# EAGLE schematic schematic (EAGLE 8.4.3)
CNAME: ZPB30A1; CREVISION: 1.1; DESIGNER: Luca Zimmermann

## Sheet 1 of 4: Power
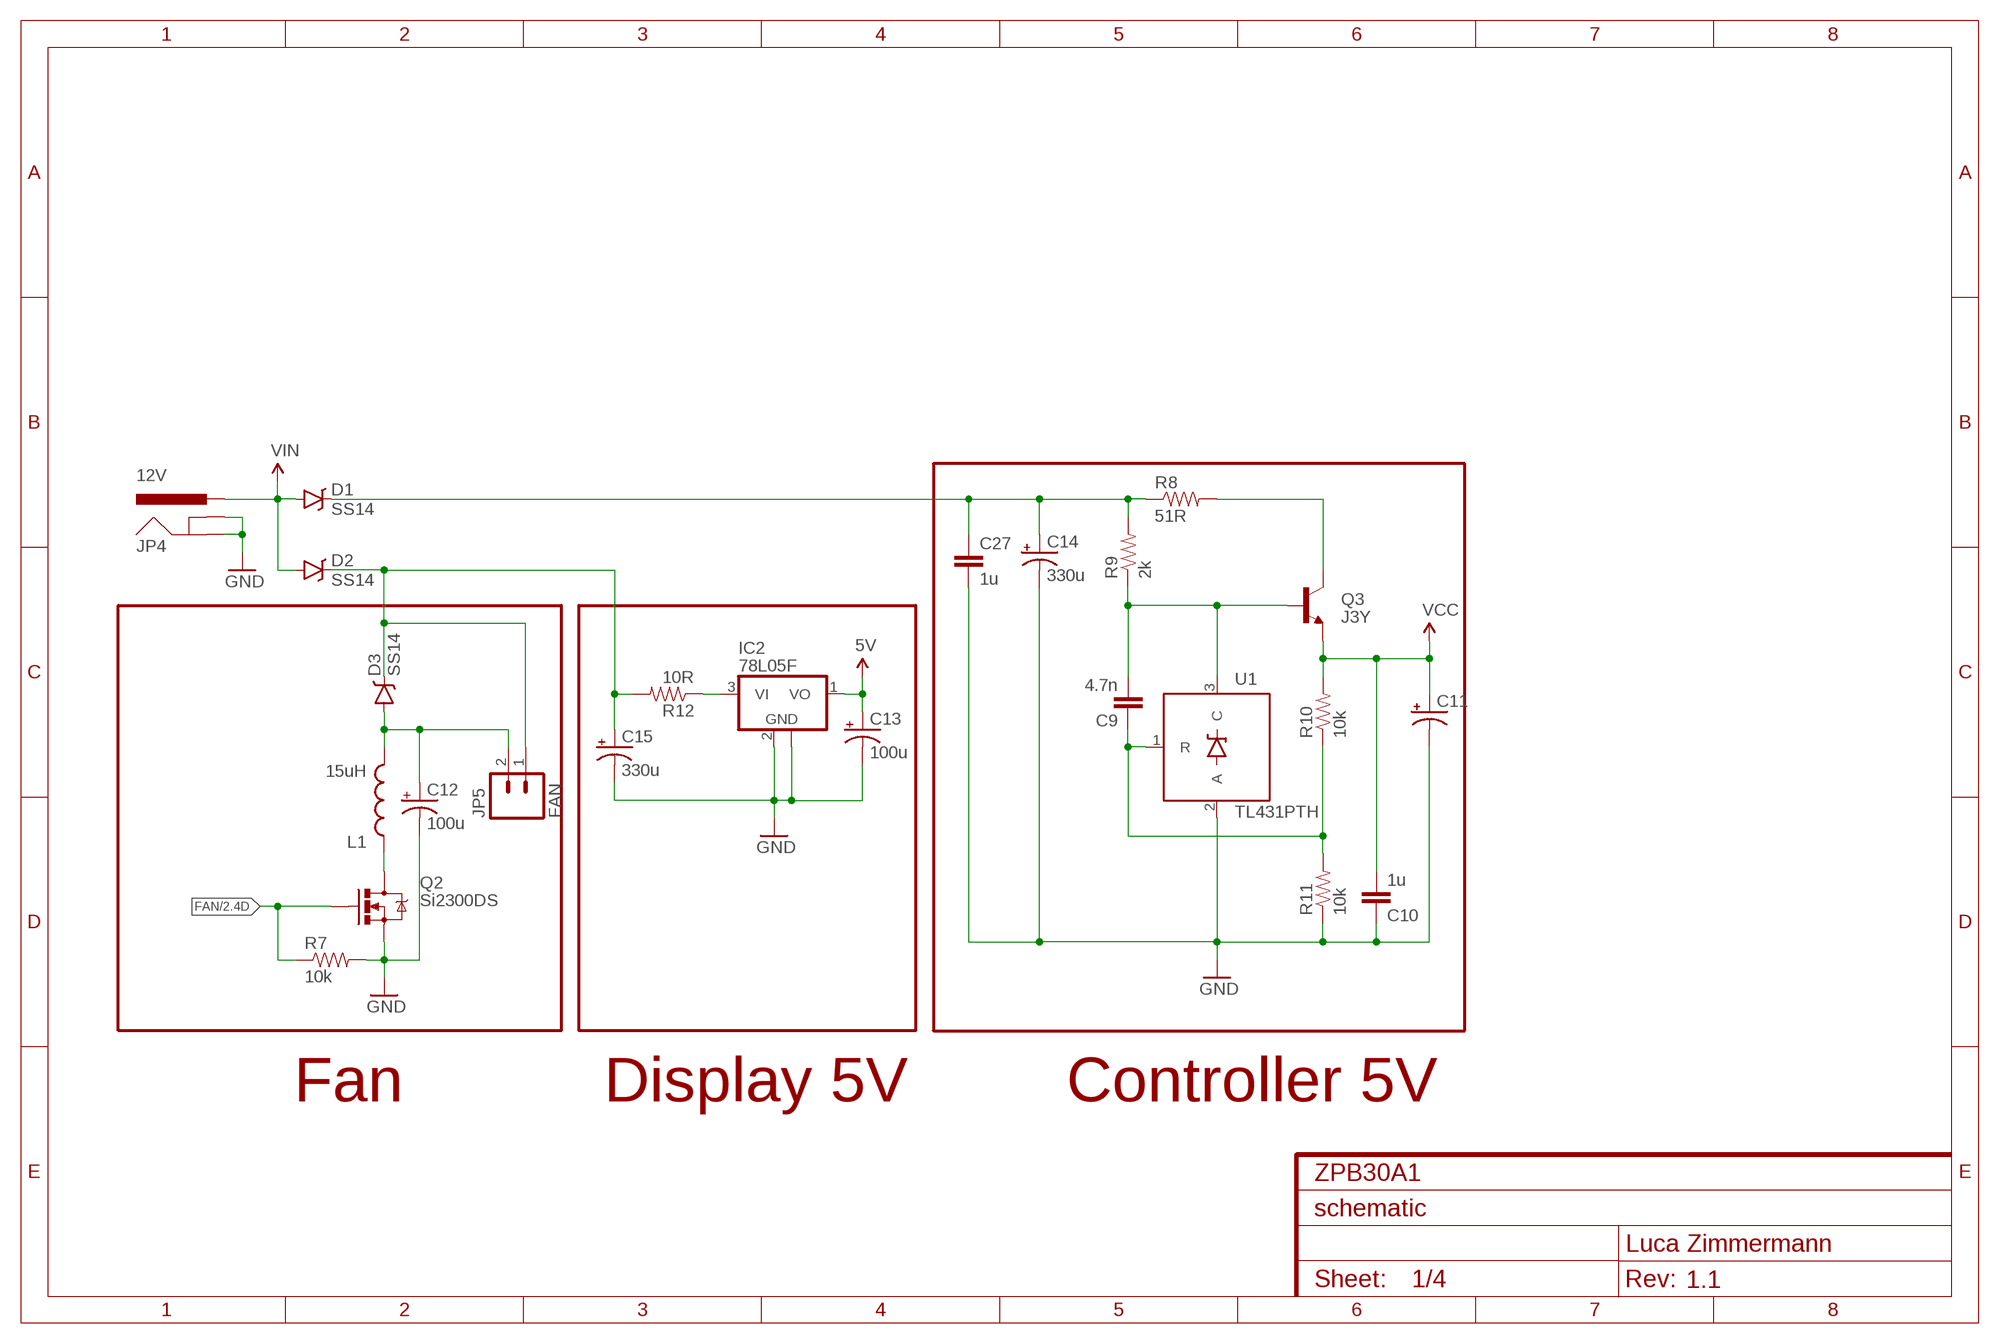
[diagram p0: schematic, sheet 1]

### Parts
C9  4.7n  CAP0805  [C0805]
C10  1u  CAP0805  [C0805]
C11  CAP_POLPTH2  [CPOL-RADIAL-10UF-25V]
C12  100u  CAP_POLPTH2  [CPOL-RADIAL-10UF-25V]
C13  100u  CAP_POLPTH2  [CPOL-RADIAL-10UF-25V]
C14  330u  CAP_POLPTH1  [CPOL-RADIAL-100UF-25V]
C15  330u  CAP_POLPTH1  [CPOL-RADIAL-100UF-25V]
C27  1u  CAP0805  [C0805]
D1  SS14  DIODE-SCHOTTKY-B340A  [SMA-DIODE]
D2  SS14  DIODE-SCHOTTKY-B340A  [SMA-DIODE]
D3  SS14  DIODE-SCHOTTKY-B340A  [SMA-DIODE]
IC2  78L05F  [SOT89]
JP4  12V  POWER_JACKSLT  [POWER_JACK_SLOT]
JP5  FAN  M02PTH4  [1X02_XTRA_BIG]
L1  15uH  INDUCTOR-B82462G  [B82462G]
Q2  Si2300DS  MOSFET-NCHANNELAO3404A  [SOT23-3]
Q3  J3Y  TRANSISTOR_NPNMMBT5088  [SOT23-3]
R7  10k  RESISTOR0805-RES  [R0805]
R8  51R  RESISTOR0805-RES  [R0805]
R9  2k  RESISTOR0805-RES  [R0805]
R10  10k  RESISTOR0805-RES  [R0805]
R11  10k  RESISTOR0805-RES  [R0805]
R12  10R  RESISTOR0805-RES  [R0805]
U1  TL431PTH  [TO-92]

### Nets
5V: C13.1(+) IC2.1(VO) ; also sheet 2
FAN: Q2.1(G) R7.1 ; also sheet 2
FAN-: C12.1(+) D3.A JP5.2 L1.P$2
GND: C10.1 C11.2(-) C12.2(-) C13.2(-) C14.2(-) C15.2(-) C27.2 IC2.2(GND) IC2.2@1(GND) JP4.GND@1(GNDBREAK) JP4.GND@2(GND) Q2.2(S) R7.2 R11.1 U1.2(A) ; also sheet 2,3
N$1: C9.2 Q3.1(B) R9.1 U1.3(C)
N$2: L1.P$1 Q2.3(D)
N$3: C15.1(+) D2.C D3.C JP5.1 R12.2
N$4: Q3.3(C) R8.2
N$5: C14.1(+) C27.1 D1.C R8.1 R9.2
N$6: C9.1 R10.1 R11.2 U1.1(R)
N$10: IC2.3(VI) R12.1
VCC: C10.2 C11.1(+) Q3.2(E) R10.2 ; also sheet 2,3
VIN: D1.A D2.A JP4.PWR

### Notes on the sheet
- Fan | Display 5V | Controller 5V

## Sheet 2 of 4: Controller
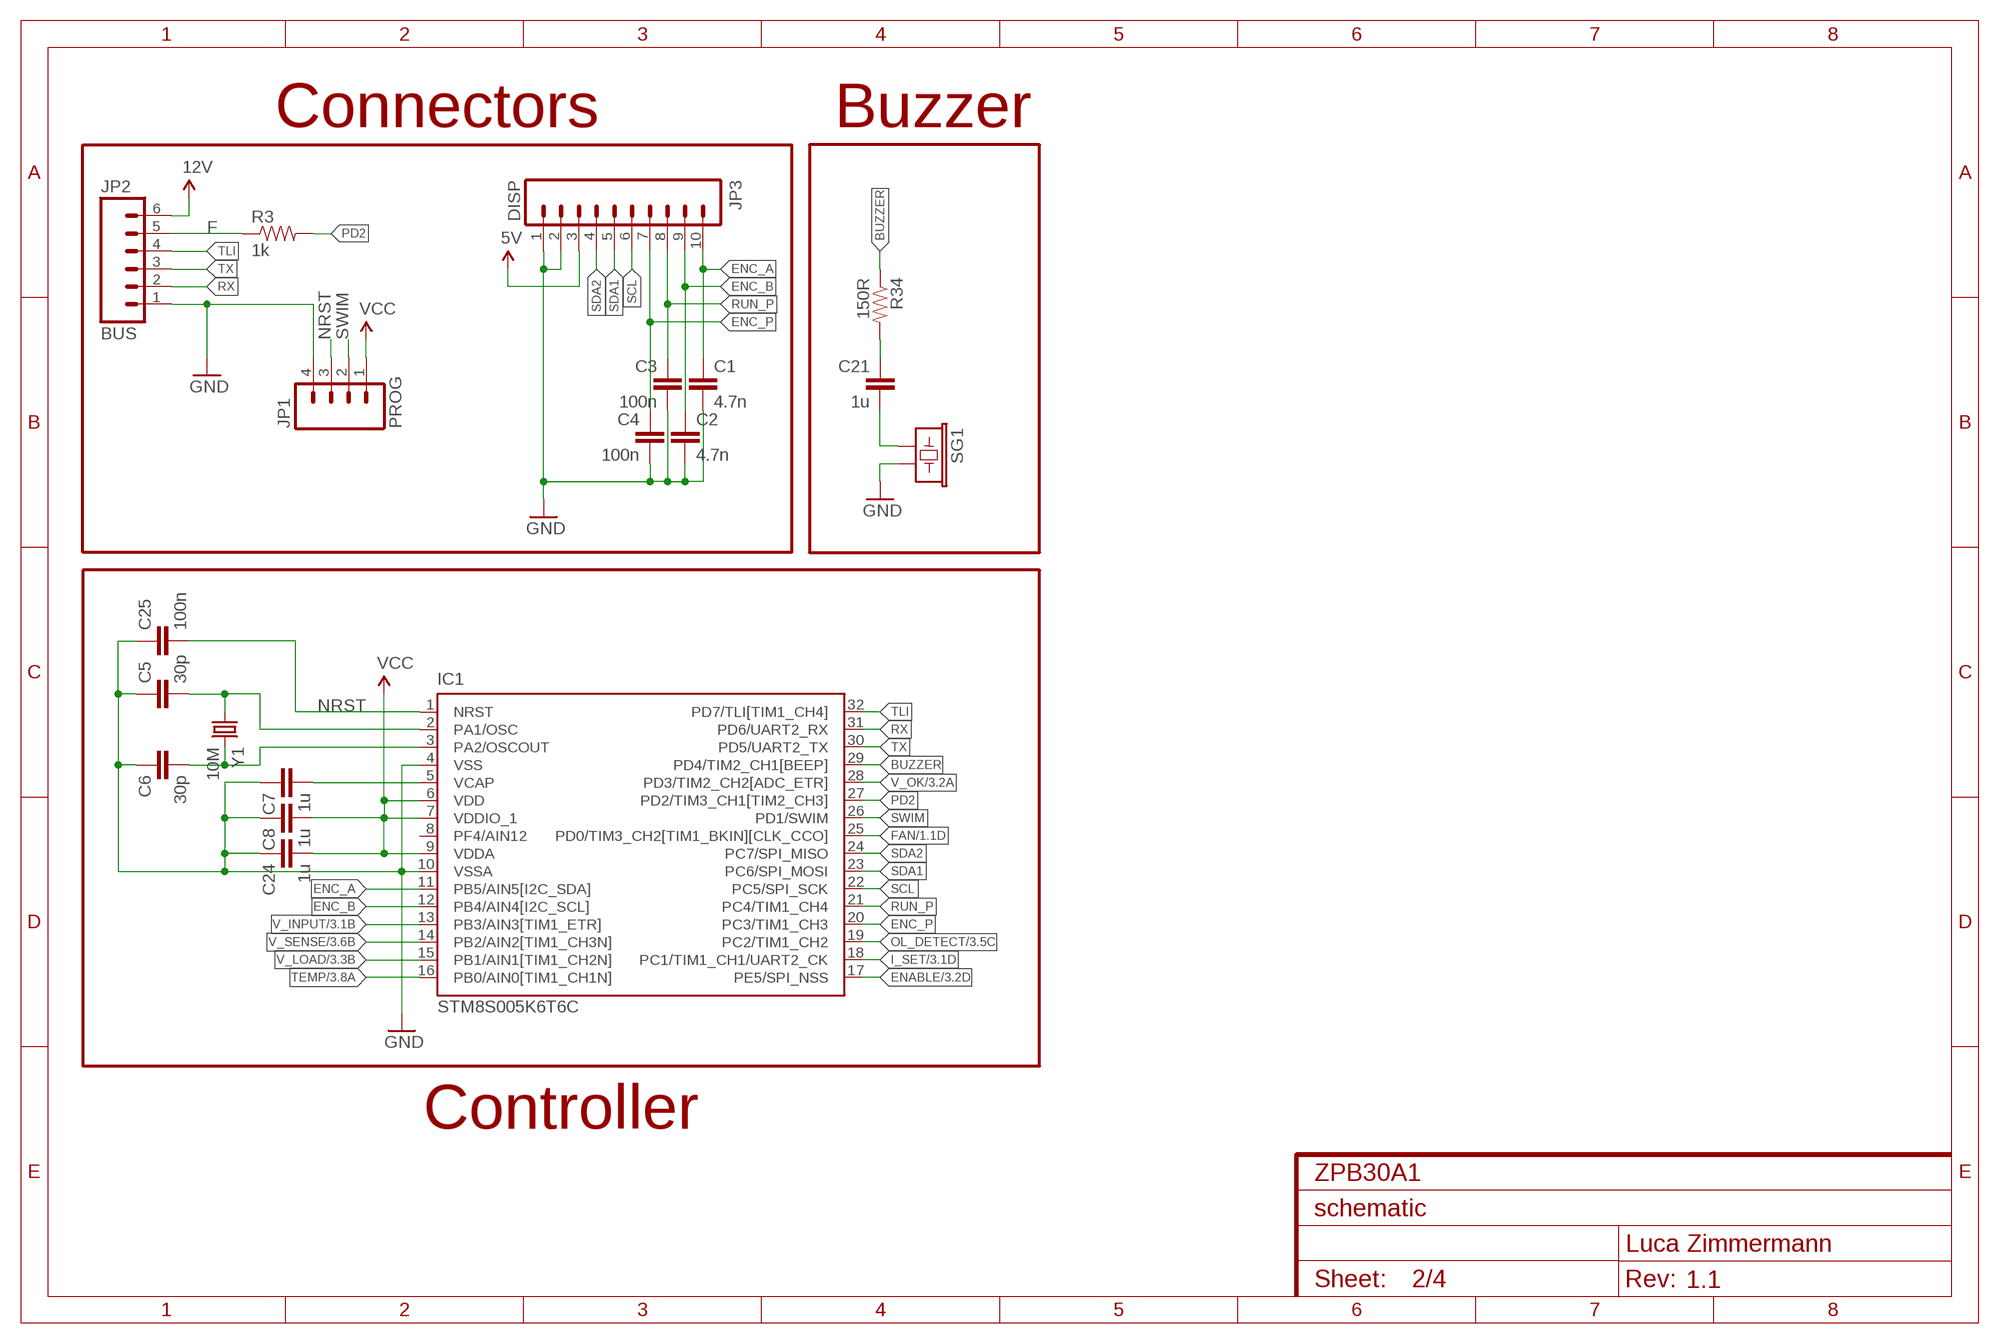
[diagram p1: schematic, sheet 2]

### Parts
C1  4.7n  CAP0805  [C0805]
C2  4.7n  CAP0805  [C0805]
C3  100n  CAP0805  [C0805]
C4  100n  CAP0805  [C0805]
C5  30p  CAP0805  [C0805]
C6  30p  CAP0805  [C0805]
C7  1u  CAP0805  [C0805]
C8  1u  CAP0805  [C0805]
C21  1u  CAP0805  [C0805]
C24  1u  CAP0805  [C0805]
C25  100n  CAP0805  [C0805]
IC1  STM8S005K6T6C  STM8S105K4T  [LQFP32-7X7]
JP1  PROG  M04PTH  [1X04]
JP2  BUS  M06SILK_FEMALE_PTH  [1X06]
JP3  DISP  M10SILK_FEMALE_PTH  [1X10]
R3  1k  RESISTOR0805-RES  [R0805]
R34  150R  RESISTOR0805-RES  [R0805]
SG1  BUZZERPTH  [BUZZER-12MM]
Y1  10M  CRYSTALSMD  [HC49UP]

### Nets
5V: JP3.3 ; also sheet 1
12V: JP2.6 ; also sheet 3
BUZZER: IC1.29(PD4/TIM2_CH1[BEEP]) R34.1
ENABLE: IC1.17(PE5/SPI_NSS) ; also sheet 3
ENC_A: C1.1 IC1.11(PB5/AIN5[I2C_SDA]) JP3.10
ENC_B: C2.1 IC1.12(PB4/AIN4[I2C_SCL]) JP3.9
ENC_P: C4.1 IC1.20(PC3/TIM1_CH3) JP3.7
F: JP2.5 R3.1
FAN: IC1.25(PD0/TIM3_CH2[TIM1_BKIN][CLK_CCO]) ; also sheet 1
GND: C1.2 C2.2 C3.2 C4.2 C5.1 C6.1 C7.1 C8.1 C24.1 C25.1 IC1.4(VSS) IC1.10(VSSA) JP1.4 JP2.1 JP3.1 JP3.2 SG1.- ; also sheet 1,3
I_SET: IC1.18(PC1/TIM1_CH1/UART2_CK) ; also sheet 3
N$12: C7.2 IC1.5(VCAP)
N$14: C6.2 IC1.3(PA2/OSCOUT) Y1.2
N$15: C5.2 IC1.2(PA1/OSC) Y1.1
N$30: C21.2 SG1.+
N$31: C21.1 R34.2
NRST: C25.2 IC1.1(NRST) JP1.3
OL_DETECT: IC1.19(PC2/TIM1_CH2) ; also sheet 3
PD2: IC1.27(PD2/TIM3_CH1[TIM2_CH3]) R3.2
RUN_P: C3.1 IC1.21(PC4/TIM1_CH4) JP3.8
RX: IC1.31(PD6/UART2_RX) JP2.2
SCL: IC1.22(PC5/SPI_SCK) JP3.6
SDA1: IC1.23(PC6/SPI_MOSI) JP3.5
SDA2: IC1.24(PC7/SPI_MISO) JP3.4
SWIM: IC1.26(PD1/SWIM) JP1.2
TEMP: IC1.16(PB0/AIN0[TIM1_CH1N]) ; also sheet 3
TLI: IC1.32(PD7/TLI[TIM1_CH4]) JP2.4
TX: IC1.30(PD5/UART2_TX) JP2.3
V_INPUT: IC1.13(PB3/AIN3[TIM1_ETR]) ; also sheet 3
V_LOAD: IC1.15(PB1/AIN1[TIM1_CH2N]) ; also sheet 3
V_OK: IC1.28(PD3/TIM2_CH2[ADC_ETR]) ; also sheet 3
V_SENSE: IC1.14(PB2/AIN2[TIM1_CH3N]) ; also sheet 3
VCC: C8.2 C24.2 IC1.6(VDD) IC1.7(VDDIO_1) IC1.9(VDDA) JP1.1 ; also sheet 1,3
Unconnected: IC1.8(PF4/AIN12)

### Notes on the sheet
- Connectors | Buzzer
- Controller

## Sheet 3 of 4: Measurement
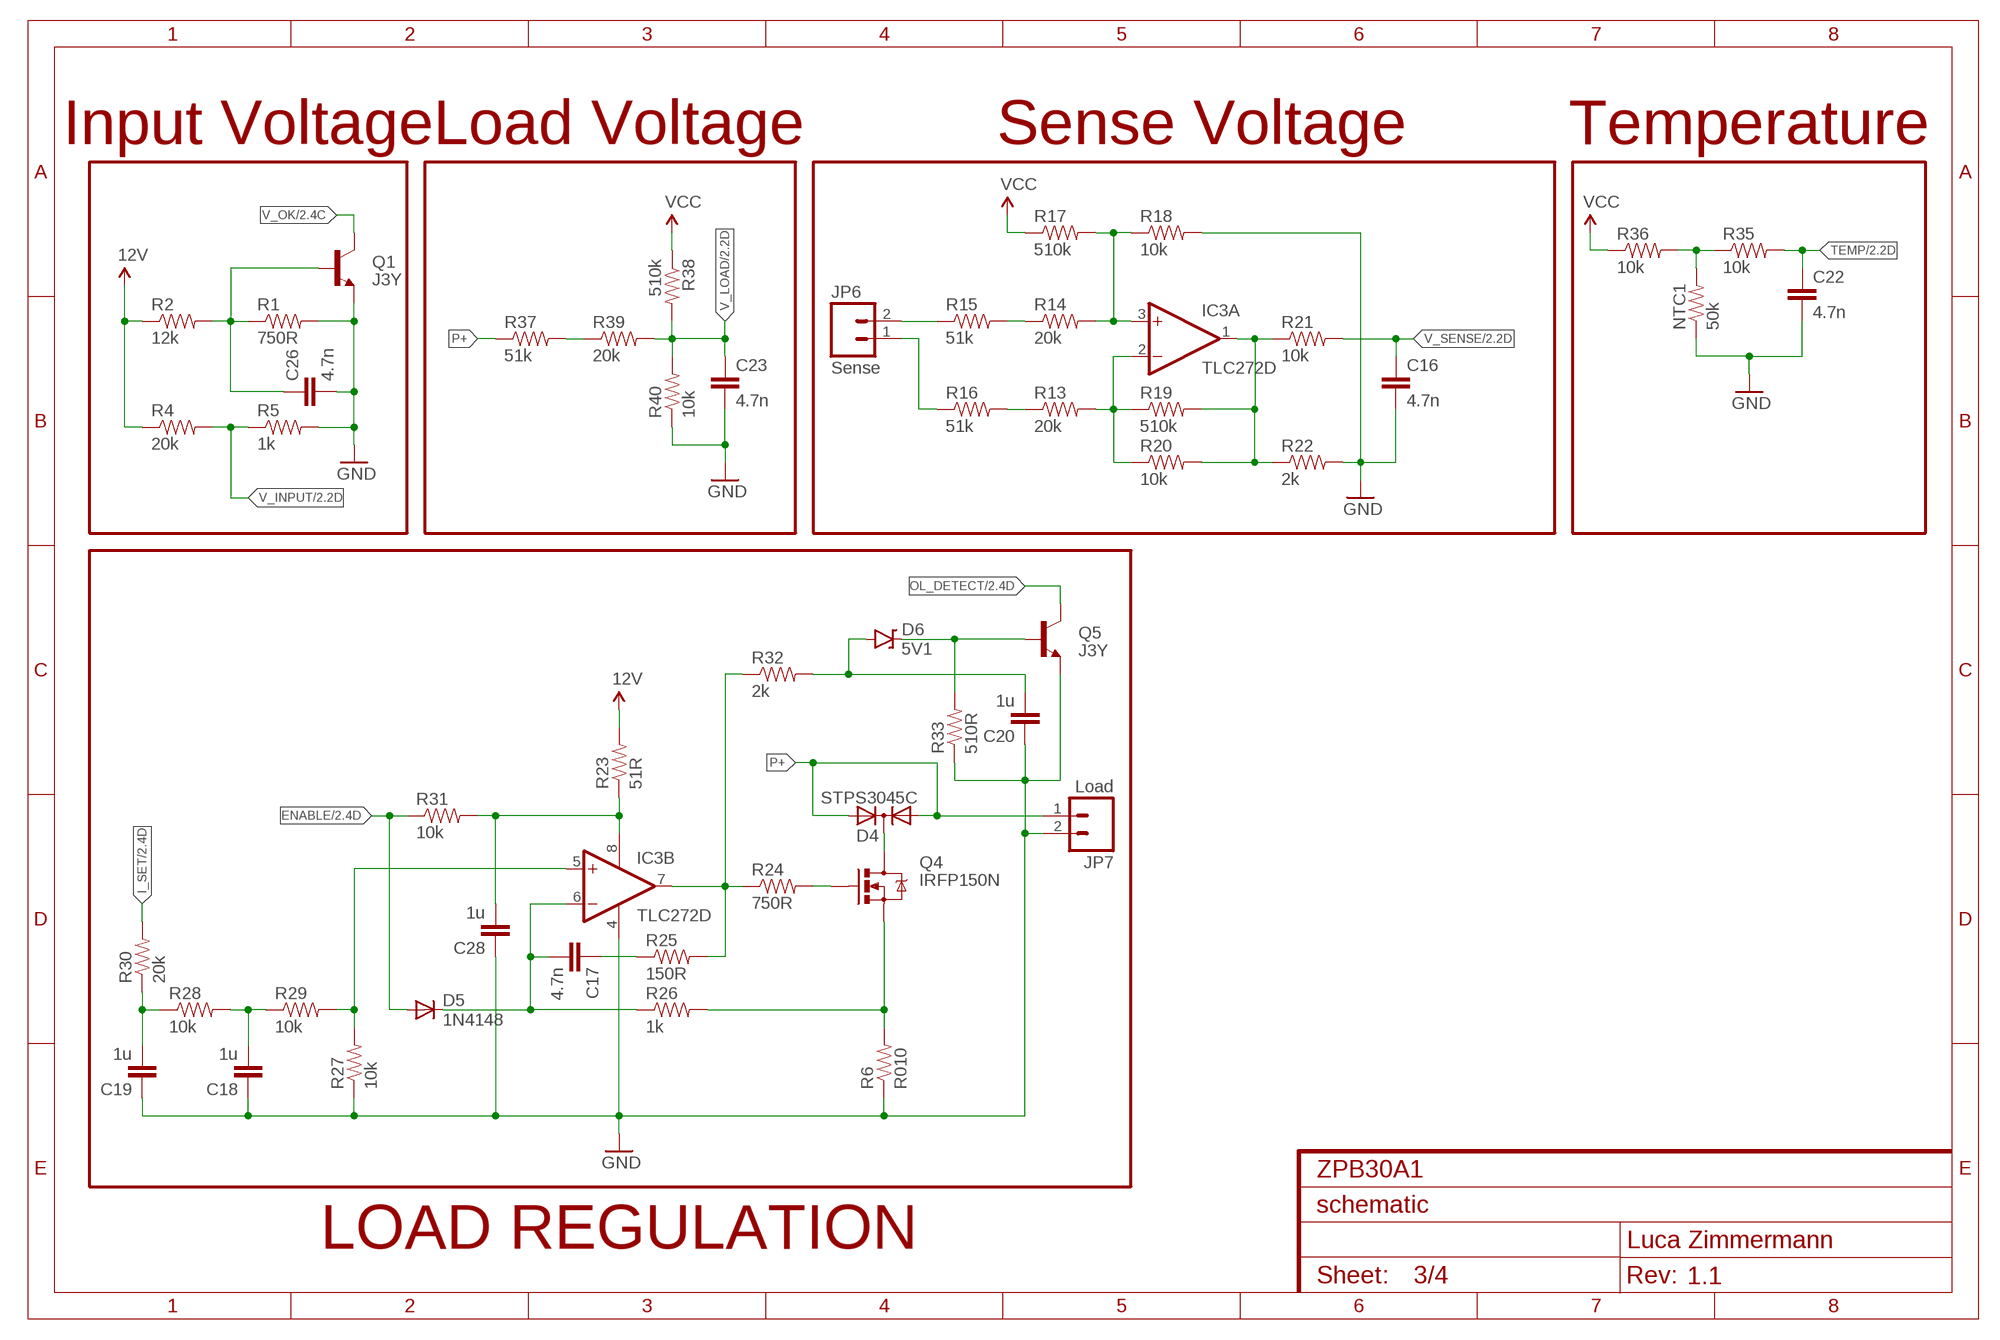
[diagram p2: schematic, sheet 3]

### Parts
C16  4.7n  CAP0805  [C0805]
C17  4.7n  CAP0805  [C0805]
C18  1u  CAP0805  [C0805]
C19  1u  CAP0805  [C0805]
C20  1u  CAP0805  [C0805]
C22  4.7n  CAP0805  [C0805]
C23  4.7n  CAP0805  [C0805]
C26  4.7n  CAP0805  [C0805]
C28  1u  CAP0805  [C0805]
D4  STPS3045C  FEP16AT  [TO220ABS]
D5  1N4148  DIODE-MINIMELF  [MINIMELF]
D6  5V1  DIODE-ZENER16V  [SOD-123]
IC3  TLC272D  [SO08]
JP6  Sense  M02JST-PTH-VERT  [JST-2-PTH-VERT]
JP7  Load  M025MM  [SCREWTERMINAL-5MM-2]
NTC1  50k  RESISTORAXIAL-0.3  [AXIAL-0.3]
Q1  J3Y  TRANSISTOR_NPNMMBT5088  [SOT23-3]
Q4  IRFP150N  MOSFET-NCHANNELFQP30N06L  [TO220V]
Q5  J3Y  TRANSISTOR_NPNMMBT5088  [SOT23-3]
R1  750R  RESISTOR0805-RES  [R0805]
R2  12k  RESISTOR0805-RES  [R0805]
R4  20k  RESISTOR0805-RES  [R0805]
R5  1k  RESISTOR0805-RES  [R0805]
R6  R010  RESISTORPTH-1W  [AXIAL-0.6]
R13  20k  RESISTOR0805-RES  [R0805]
R14  20k  RESISTOR0805-RES  [R0805]
R15  51k  RESISTOR0805-RES  [R0805]
R16  51k  RESISTOR0805-RES  [R0805]
R17  510k  RESISTOR0805-RES  [R0805]
R18  10k  RESISTOR0805-RES  [R0805]
R19  510k  RESISTOR0805-RES  [R0805]
R20  10k  RESISTOR0805-RES  [R0805]
R21  10k  RESISTOR0805-RES  [R0805]
R22  2k  RESISTOR0805-RES  [R0805]
R23  51R  RESISTOR0805-RES  [R0805]
R24  750R  RESISTOR0805-RES  [R0805]
R25  150R  RESISTOR0805-RES  [R0805]
R26  1k  RESISTOR0805-RES  [R0805]
R27  10k  RESISTOR0805-RES  [R0805]
R28  10k  RESISTOR0805-RES  [R0805]
R29  10k  RESISTOR0805-RES  [R0805]
R30  20k  RESISTOR0805-RES  [R0805]
R31  10k  RESISTOR0805-RES  [R0805]
R32  2k  RESISTOR0805-RES  [R0805]
R33  510R  RESISTOR0805-RES  [R0805]
R35  10k  RESISTOR0805-RES  [R0805]
R36  10k  RESISTOR0805-RES  [R0805]
R37  51k  RESISTOR0805-RES  [R0805]
R38  510k  RESISTOR0805-RES  [R0805]
R39  20k  RESISTOR0805-RES  [R0805]
R40  10k  RESISTOR0805-RES  [R0805]

### Nets
12V: R2.1 R4.1 R23.2 ; also sheet 2
ENABLE: D5.A R31.1 ; also sheet 2
GND: C16.2 C18.1 C19.1 C20.1 C22.2 C23.2 C26.2 C28.1 IC3.4(P:V-) JP7.2 NTC1.P$1 Q1.2(E) Q5.2(E) R1.2 R5.2 R6.P$1 R18.2 R22.2 R27.1 R33.1 R40.1 ; also sheet 1,2
I_SET: R30.2 ; also sheet 2
N$7: IC3.2(A:-IN) R13.2 R19.1 R20.1
N$8: C26.1 Q1.1(B) R1.1 R2.2
N$9: IC3.3(A:+IN) R14.2 R17.2 R18.1
N$11: R14.1 R15.2
N$13: R13.1 R16.2
N$16: JP6.1 R16.1
N$17: JP6.2 R15.1
N$18: IC3.1(A:OUT) R19.2 R20.2 R21.1 R22.1
N$19: C28.2 IC3.8(P:V+) R23.1 R31.2
N$20: IC3.7(B:OUT) R24.1 R25.2 R32.1
N$21: C17.1 R25.1
N$22: C17.2 D5.C IC3.6(B:-IN) R26.1
N$23: Q4.3(S) R6.P$2 R26.2
N$24: Q4.1(G) R24.2
N$25: C19.2 R28.1 R30.1
N$26: D4.C Q4.2(D)
N$27: IC3.5(B:+IN) R27.2 R29.2
N$28: C20.2 D6.A R32.2
N$29: C18.2 R28.2 R29.1
N$32: D6.C Q5.1(B) R33.2
N$33: NTC1.P$2 R35.1 R36.2
N$35: R37.2 R39.1
OL_DETECT: Q5.3(C) ; also sheet 2
P+: D4.A1 D4.A2 JP7.1 R37.1
TEMP: C22.1 R35.2 ; also sheet 2
V_INPUT: R4.2 R5.1 ; also sheet 2
V_LOAD: C23.1 R38.2 R39.2 R40.2 ; also sheet 2
V_OK: Q1.3(C) ; also sheet 2
V_SENSE: C16.1 R21.2 ; also sheet 2
VCC: R17.1 R36.1 R38.1 ; also sheet 1,2

### Notes on the sheet
- Input Voltage | Load Voltage | Sense Voltage | Temperature
- LOAD REGULATION

## Sheet 4 of 4: Displayboard
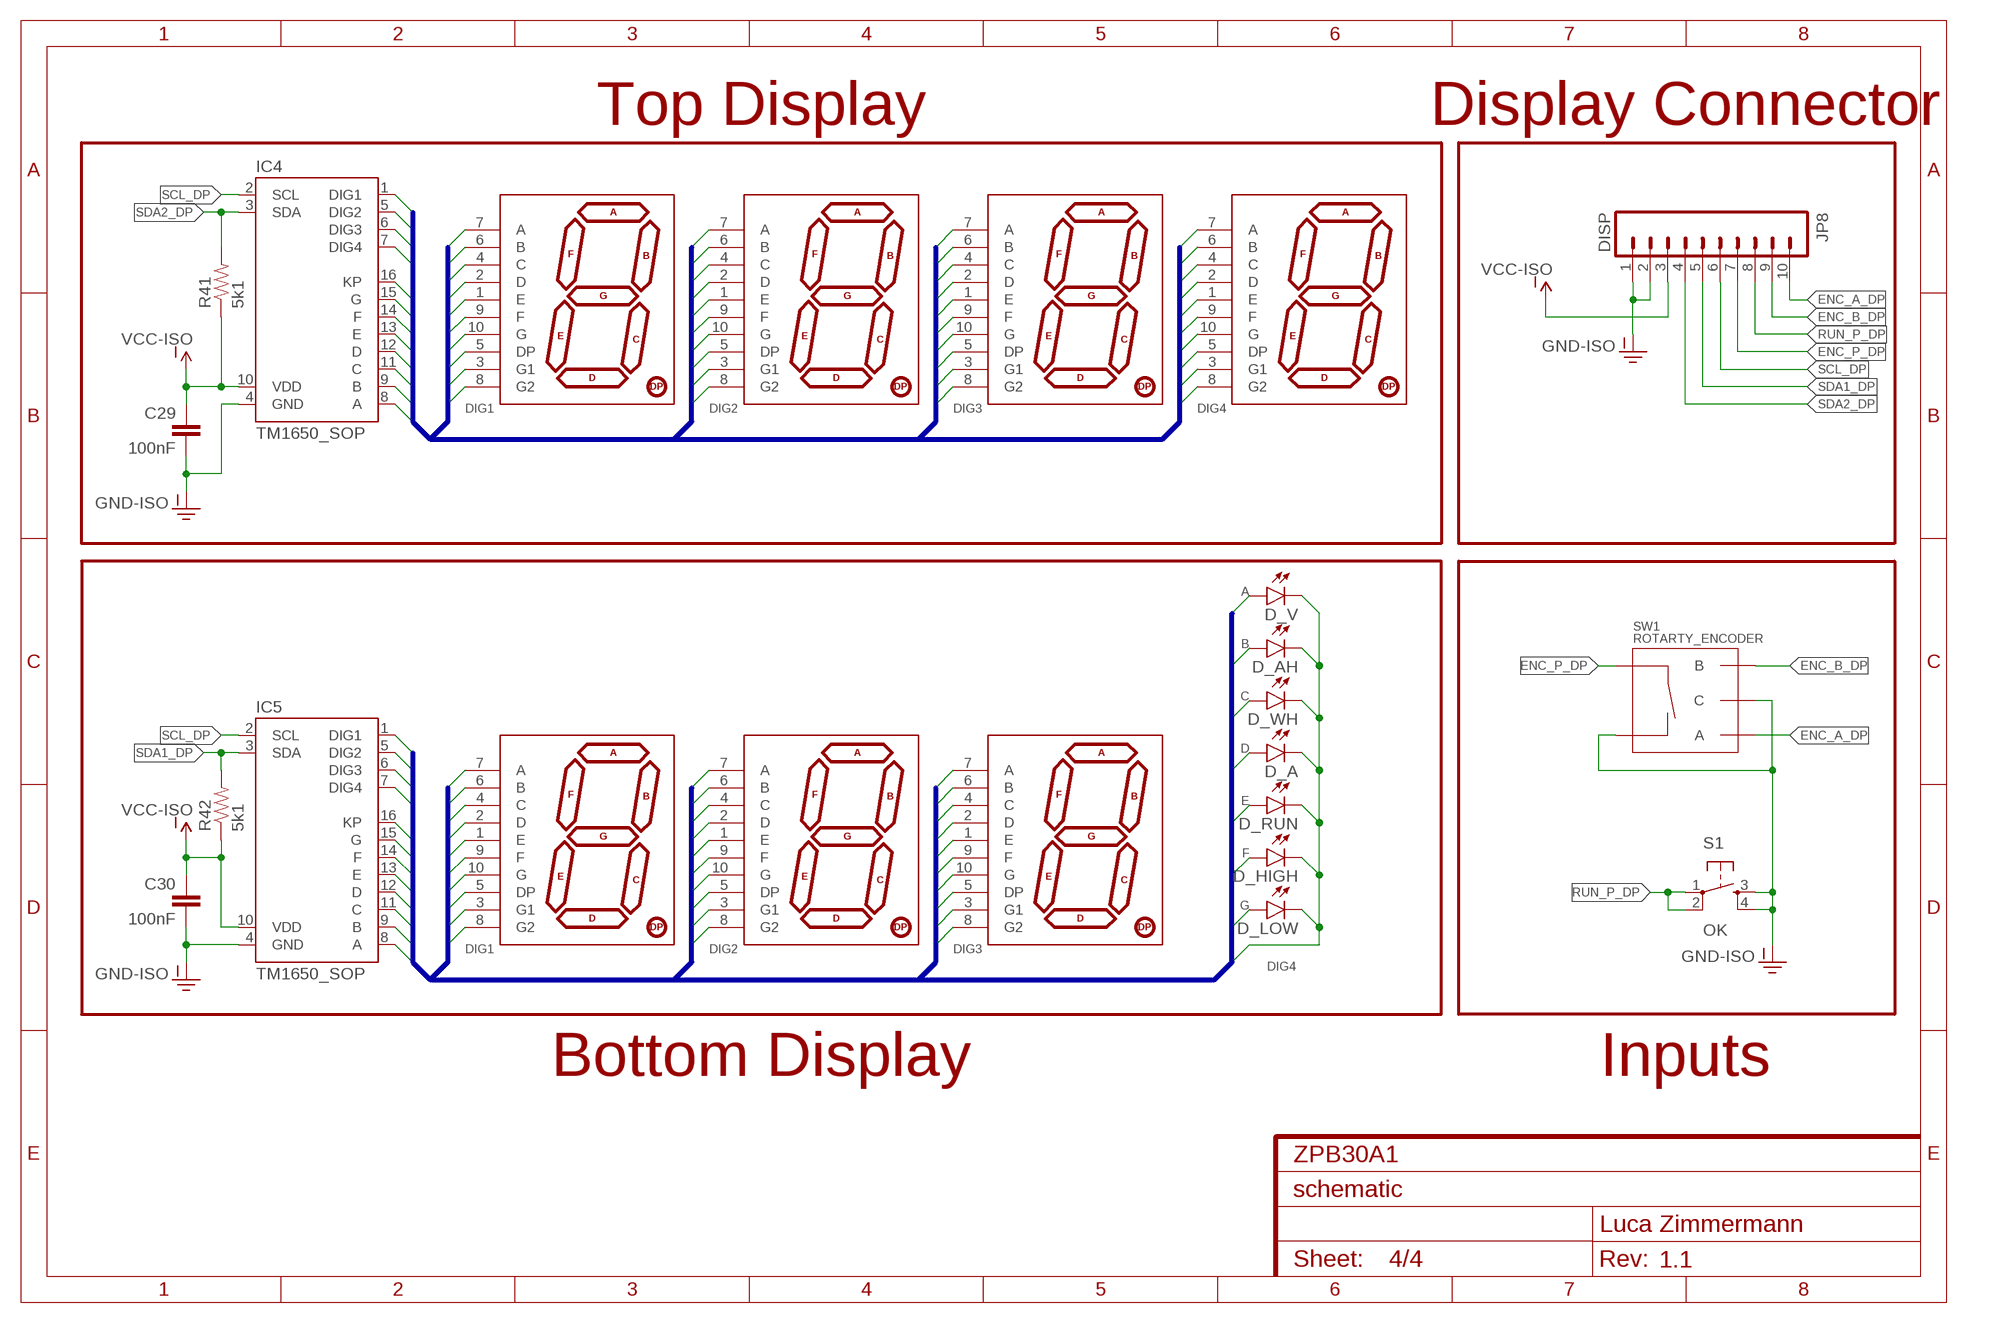
[diagram p3: schematic, sheet 4]

### Parts
C29  100nF  CAP0805  [C0805]
C30  100nF  CAP0805  [C0805]
D_A  LED3MM  [LED3MM]
D_AH  LED3MM  [LED3MM]
D_HIGH  LED3MM  [LED3MM]
D_LOW  LED3MM  [LED3MM]
D_RUN  LED3MM  [LED3MM]
D_V  LED3MM  [LED3MM]
D_WH  LED3MM  [LED3MM]
DP1_DIG1  7-SEGMENT-DISPLAY-1"-RED  [7-SEGMENT-1"PTH]
DP1_DIG2  7-SEGMENT-DISPLAY-1"-RED  [7-SEGMENT-1"PTH]
DP1_DIG3  7-SEGMENT-DISPLAY-1"-RED  [7-SEGMENT-1"PTH]
DP1_DIG4  7-SEGMENT-DISPLAY-1"-RED  [7-SEGMENT-1"PTH]
DP2_DIG1  7-SEGMENT-DISPLAY-1"-RED  [7-SEGMENT-1"PTH]
DP2_DIG2  7-SEGMENT-DISPLAY-1"-RED  [7-SEGMENT-1"PTH]
DP2_DIG3  7-SEGMENT-DISPLAY-1"-RED  [7-SEGMENT-1"PTH]
IC4  TM1650_SOP  [SOP16]
IC5  TM1650_SOP  [SOP16]
JP8  DISP  M10SILK_FEMALE_PTH  [1X10]
R41  5k1  RESISTOR0805-RES  [R0805]
R42  5k1  RESISTOR0805-RES  [R0805]
S1  OK  SWITCH-MOMENTARY-4_PTH  [TACTILE-PTH]
SW1  ROTARTY_ENCODER  [ROTARY_ENC_PLAIN]

### Nets
DP1: DP1_DIG1.1(E) DP1_DIG1.2(D) DP1_DIG1.3(G1) DP1_DIG1.4(C) DP1_DIG1.5(DP) DP1_DIG1.6(B) DP1_DIG1.7(A) DP1_DIG1.8(G2) DP1_DIG1.9(F) DP1_DIG1.10(G) DP1_DIG2.1(E) DP1_DIG2.2(D) DP1_DIG2.3(G1) DP1_DIG2.4(C) DP1_DIG2.5(DP) DP1_DIG2.6(B) DP1_DIG2.7(A) DP1_DIG2.8(G2) DP1_DIG2.9(F) DP1_DIG2.10(G) DP1_DIG3.1(E) DP1_DIG3.2(D) DP1_DIG3.3(G1) DP1_DIG3.4(C) DP1_DIG3.5(DP) DP1_DIG3.6(B) DP1_DIG3.7(A) DP1_DIG3.8(G2) DP1_DIG3.9(F) DP1_DIG3.10(G) DP1_DIG4.1(E) DP1_DIG4.2(D) DP1_DIG4.3(G1) DP1_DIG4.4(C) DP1_DIG4.5(DP) DP1_DIG4.6(B) DP1_DIG4.7(A) DP1_DIG4.8(G2) DP1_DIG4.9(F) DP1_DIG4.10(G) IC4.1(DIG1) IC4.5(DIG2) IC4.6(DIG3) IC4.7(DIG4) IC4.8(A) IC4.9(B) IC4.11(C) IC4.12(D) IC4.13(E) IC4.14(F) IC4.15(G) IC4.16(KP)
DP2: D_A.A D_A.K(C) D_AH.A D_AH.K(C) D_HIGH.A D_HIGH.K(C) D_LOW.A D_LOW.K(C) D_RUN.A D_RUN.K(C) D_V.A D_V.K(C) D_WH.A D_WH.K(C) DP2_DIG1.1(E) DP2_DIG1.2(D) DP2_DIG1.3(G1) DP2_DIG1.4(C) DP2_DIG1.5(DP) DP2_DIG1.6(B) DP2_DIG1.7(A) DP2_DIG1.8(G2) DP2_DIG1.9(F) DP2_DIG1.10(G) DP2_DIG2.1(E) DP2_DIG2.2(D) DP2_DIG2.3(G1) DP2_DIG2.4(C) DP2_DIG2.5(DP) DP2_DIG2.6(B) DP2_DIG2.7(A) DP2_DIG2.8(G2) DP2_DIG2.9(F) DP2_DIG2.10(G) DP2_DIG3.1(E) DP2_DIG3.2(D) DP2_DIG3.3(G1) DP2_DIG3.4(C) DP2_DIG3.5(DP) DP2_DIG3.6(B) DP2_DIG3.7(A) DP2_DIG3.8(G2) DP2_DIG3.9(F) DP2_DIG3.10(G) IC5.1(DIG1) IC5.5(DIG2) IC5.6(DIG3) IC5.7(DIG4) IC5.8(A) IC5.9(B) IC5.11(C) IC5.12(D) IC5.13(E) IC5.14(F) IC5.15(G) IC5.16(KP)
ENC_A_DP: JP8.10 SW1.A
ENC_B_DP: JP8.9 SW1.B
ENC_P_DP: JP8.7 SW1.SW+
GND-ISO: C29.2 C30.2 IC4.4(GND) IC5.4(GND) JP8.1 JP8.2 S1.3 S1.4 SW1.C SW1.SW-
RUN_P_DP: JP8.8 S1.1 S1.2
SCL_DP: IC4.2(SCL) IC5.2(SCL) JP8.6
SDA1_DP: IC5.3(SDA) JP8.5 R42.2
SDA2_DP: IC4.3(SDA) JP8.4 R41.2
VCC-ISO: C29.1 C30.1 IC4.10(VDD) IC5.10(VDD) JP8.3 R41.1 R42.1

### Buses
DP1
DP2

### Notes on the sheet
- Top Display | Display Connector
- DIG1 | DIG2 | DIG3 | DIG4
- A
- B
- C
- D
- E
- F
- G
- DIG1 | DIG2 | DIG3
- DIG4
- Bottom Display | Inputs

## Library data of the parts
C1-C10 C16-C30 = SparkFun-Capacitors:CAP: Capacitor Standard 0603 ceramic capacitor, and 0.1" leaded capacitor.
C11-C15 = SparkFun-Capacitors:CAP_POL: Capacitor Polarized These are standard SMD and PTH capacitors. Normally 10uF, 47uF, and 100uF in electrolytic and tantalum varieties. Always verify the external diameter of the through hole cap, it varies with capacity, voltage, and manufacturer. The EIA devices should be standard.
D1-D3 = SparkFun-DiscreteSemi:DIODE-SCHOTTKY: Schottky diodes in SFE's production catalog BAT20J 1A 23V 0.62Vf RB751 120mA 40V 0.37Vf PMEG4005EJ 0.5A 40V 0.42Vf MBRA140 1A 40V 0.5Vf B340A 3A 40V SMA; PROD_ID: DIO-09886; VALUE: B340A
D4 = diode:FEP16AT: DIODE dual ultra-fast recovery rectifier, common cathode
D5 = diode:DIODE-: DIODE
D6 = SparkFun-DiscreteSemi:DIODE-ZENER: Zener Diode Production Part - 8199 3.4V Zener Voltage; PROD_ID: DIO-12440; VALUE: 16V
D_A D_AH D_HIGH D_LOW D_RUN D_V D_WH = SparkFun-LED:LED: LEDs Standard schematic elements and footprints for 5mm, 3mm, 1206, and 0603 sized LEDs. 5mm - Spark Fun Electronics SKU : COM-00529 (and others)
DP1_DIG1-DP1_DIG4 DP2_DIG1-DP2_DIG3 = SparkFun-Displays:7-SEGMENT-DISPLAY-1"-RED: 7-Segment Display 1" Red (COM-08546) EZ is for kits. Pads are only exposed on the bottom side to help prevent soldering in upside down.
IC1 = st-microelectronics:STM8S105K: Access line, 16 MHz STM8S 8-bit MCU up to 32 Kbytes Flash, integrated EEPROM,10-bit ADC, timers, UART, SPI, I²C Source: Data sheet <http://www.st.com/stonline/products/literature/ds/14771/stm8s105c4.pdf>; MPN: STM8S105K4T6C; OC_FARNELL: 1706223; OC_NEWARK: 09R6034
IC2 = linear:78L*: POSITOIV-VOLTAGE REGULATORS Output up to 100 mA Source: Datasheet <http://focus.ti.com/lit/ds/symlink/ua78l05.pdf>
IC3 = linear:TLC272: OP AMP
IC4 IC5 = rgb_matrix:TM1650
JP1 = SparkFun-Connectors:M04: Header 4 Standard 4-pin 0.1" header. Use with straight break away headers (SKU : PRT-00116), right angle break away headers (PRT-00553), swiss pins (PRT-00743), machine pins (PRT-00117), and female headers (PRT-00115). Molex polarized connector foot print use with SKU : PRT-08231 with associated crimp pins and housings. 1MM SMD Version SKU: PRT-10208
JP2 = SparkFun-Connectors:M06: Header 6 Standard 6-pin 0.1" header. Use with straight break away headers (SKU : PRT-00116), right angle break away headers (PRT-00553), swiss pins (PRT-00743), machine pins (PRT-00117), and female headers (PRT-00115). Molex polarized connector foot print use with SKU : PRT-08094 with associated crimp pins and housings. NOTES ON THE VARIANTS LOCK and LOCK_LONGPADS... This footprint was designed to help hold the alignment of a through-hole component (i.e. 6-pin header) while soldering it into place. You may notice that each hole has been shifted either up or down by 0.005 of an inch from it's more standard position (which is a perfectly straight line). This slight alteration caused the pins (the squares in the middle) to touch the edges of the holes. Because they are alternating, it causes a "brace" to hold the component in place. 0.005 has proven to be the perfect amount of "off-center" position when using our standard breakaway headers. Although looks a little odd when you look at the bare footprint, once you have a header in there, the alteration is very hard to notice. Also,if you push a header all the way into place, it is covered up entirely on the bottom side. This idea of altering the position of holes to aid alignment will be further integrated into the Sparkfun Library for other footprints. It can help hold any component with 3 or more connection pins.; PROD_ID: CONN-08437
JP3 JP8 = SparkFun-Connectors:M10: Header 10 Standard 10-pin 0.1" header. Use with straight break away headers (SKU : PRT-00116), right angle break away headers (PRT-00553), swiss pins (PRT-00743), machine pins (PRT-00117), and female headers (PRT-00115).; PROD_ID: CONN-11563
JP4 = SparkFun-Connectors:POWER_JACK: Power Jack This is the standard 5.5mm barrel jack for power. The PTH is the most common, proven, reliable, footprint. The Slot footprint only works if the mill layer is transmitted to the PCB fab house so be warned. Mating wall wart : TOL-00298 (and others); PROD_ID: PRT-00119
JP5 JP6 = SparkFun-Connectors:M02: Standard 2-pin 0.1" header. Use with - straight break away headers ( PRT-00116) - right angle break away headers (PRT-00553) - swiss pins (PRT-00743) - machine pins (PRT-00117) - female headers (PRT-00115) Molex polarized connector foot print use with: PRT-08233 with associated crimp pins and housings. 2.54_SCREWTERM for use with PRT-10571. 3.5mm Screw Terminal footprints for PRT-08084 5mm Screw Terminal footprints for use with PRT-08432
JP7 = SparkFun-Connectors:M02: Standard 2-pin 0.1" header. Use with - straight break away headers ( PRT-00116) - right angle break away headers (PRT-00553) - swiss pins (PRT-00743) - machine pins (PRT-00117) - female headers (PRT-00115) Molex polarized connector foot print use with: PRT-08233 with associated crimp pins and housings. 2.54_SCREWTERM for use with PRT-10571. 3.5mm Screw Terminal footprints for PRT-08084 5mm Screw Terminal footprints for use with PRT-08432; STOREFRONT_ID: PRT-08432
L1 = SparkFun-Passives:INDUCTOR: Inductors Basic Inductor/Choke - 0603 and 1206. Footprints are not proven and vary greatly between part numbers. INDUCTOR POWER 3.3UH 4.0A SMD 0.197" L x 0.197" W x 0.177" H (5.00mm x 5.00mm x 4.50mm)
NTC1 R1-R42 = SparkFun-Resistors:RESISTOR: Resistor Basic schematic elements and footprints for 0603, 1206, and PTH resistors.
Q1 Q3 Q5 = SparkFun-DiscreteSemi:TRANSISTOR_NPN: Generic NPN BJT MMBT2222A - TRANS-08049 (SOT-23, 1A 40V) MPSA42 - TRANS-09116 (SOT-23, 500mA 300V) MMBT5088LT1G - TRANS-11160 (SOT-23, 50 mA 30V) BC547 - COM-08928 <http://www.sparkfun.com/products/8928> (TO-92 45V 100mA) (1.Collector 2.Base 3.Emitter) 2N3904 - COM-00521 <http://www.sparkfun.com/products/521> (TO-92 40V 200mA) (1.Emitter 2.Base 3.Collector) P2N2222A - COM-12852 <http://www.sparkfun.com/products/12852> (TO-92 40V 600mA) (1.Collector 2.Base 3.Emitter); PROD_ID: TRANS-11160; VALUE: MMBT5088
Q2 = SparkFun-DiscreteSemi:MOSFET-NCHANNEL: Common NMOSFET Parts MFG P/N Store ID Prod ID FDD8780 TRANS-09984 SI7820DN TRANS-11055 FDS6630A IC-08089 2N7002PW TRANS-11151 FQP30N06L COM-10213 TRANS-10060 BSS123LT1G TRANS-08345 BSS138 TRANS-00830 BS170 2N7000; PROD_ID: TRAN-12988
Q4 = SparkFun-DiscreteSemi:MOSFET-NCHANNEL: Common NMOSFET Parts MFG P/N Store ID Prod ID FDD8780 TRANS-09984 SI7820DN TRANS-11055 FDS6630A IC-08089 2N7002PW TRANS-11151 FQP30N06L COM-10213 TRANS-10060 BSS123LT1G TRANS-08345 BSS138 TRANS-00830 BS170 2N7000; PROD_ID: TRANS-10060
S1 = SparkFun-Electromechanical:SWITCH-MOMENTARY-4
SG1 = SparkFun-Electromechanical:BUZZER: Buzzer 12mm Spark Fun Electronics SKU : Comp-Buzzer
SW1 = SparkFun-Electromechanical:ROTARTY_ENCODER: Simple no LED rotary encoder Example: COM-09117
U1 = SparkFun-AnalogIC:TL431: Precision Programmable Reference
Y1 = SparkFun-FreqCtrl:CRYSTAL: Various standard crystals. Proven footprints.